# Altium project PWM.PrjPcb
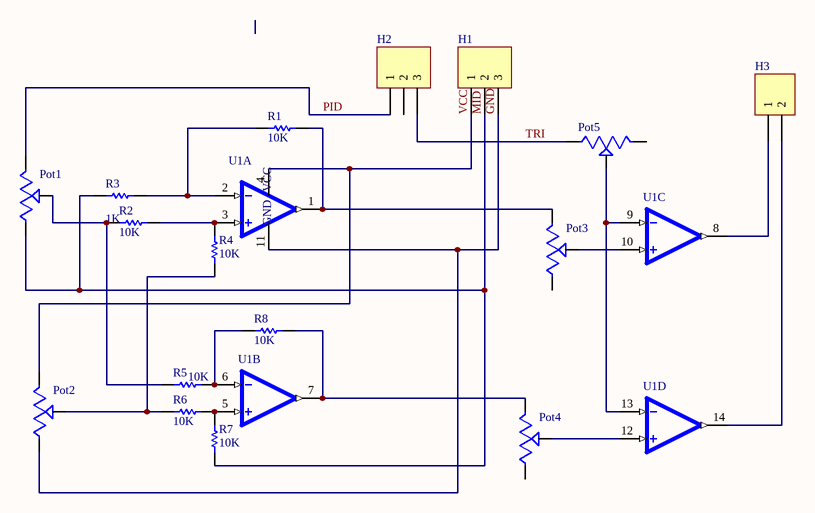
[diagram p0: pwm.SchDoc]
1 sheet, 17 parts. Net scope: global (net labels, ports and power ports of the same name join across sheets).
Board file: PWM.PcbDoc

## Sheet pwm.SchDoc
size A

### Parts
H1  Header 3  [HDR1X3]  (value not drawn)
H2  Header 3  [HDR1X3]  (value not drawn)
H3  Header 2  [HDR1X2]  (value not drawn)
Pot1  3266W-1-103  [TRIM_3266W-1-103]  (value not drawn)
Pot2  3266W-1-103  [TRIM_3266W-1-103]  (value not drawn)
Pot3  3266W-1-103  [TRIM_3266W-1-103]  (value not drawn)
Pot4  3266W-1-103  [TRIM_3266W-1-103]  (value not drawn)
Pot5  3266W-1-103  [TRIM_3266W-1-103]  (value not drawn)
R1  10K  [AXIAL-0.3]
R2  10K  [AXIAL-0.3]
R3  value 1K  [AXIAL-0.3]  (hidden comment: Res1)
R4  10K  [AXIAL-0.3]
R5  10K  [AXIAL-0.3]
R6  10K  [AXIAL-0.3]
R7  10K  [AXIAL-0.3]
R8  10K  [AXIAL-0.3]
U1  LM324NE3  [DIP794W45P254L1969H508Q14]  (value not drawn)  (parts A,B,C,D of 4)

### Nets
GND: H1.3 Pot2.1(CCW) U1.11(GND)
MID: H1.2 Pot1.1(CCW) R3.1 R7.1
PID: H2.1 Pot1.3(CW)
TRI: H2.3 Pot5.1(CCW)
VCC: H1.1 Pot2.3(CW) U1.4(VCC)
NetH3_1: H3.1 U1.8(3OUT)
NetH3_2: H3.2 U1.14(4OUT)
NetPot1_2: Pot1.2(WIPER) R2.2 R5.2
NetPot2_2: Pot2.2(WIPER) R4.2 R6.2
NetPot3_2: Pot3.2(WIPER) U1.10(3IN+)
NetPot3_3: Pot3.3(CW) R1.2 U1.1(1OUT)
NetPot4_2: Pot4.2(WIPER) U1.12(4IN+)
NetPot4_3: Pot4.3(CW) R8.2 U1.7(2OUT)
NetPot5_2: Pot5.2(WIPER) U1.9(3IN-) U1.13(4IN-)
NetR1_1: R1.1 R3.2 U1.2(1IN-)
NetR2_1: R2.1 R4.1 U1.3(1IN+)
NetR5_1: R5.1 R8.1 U1.6(2IN-)
NetR6_1: R6.1 R7.2 U1.5(2IN+)

Not connected (* = marked no-connect by the designer): H2 2; Pot3 1(CCW); Pot4 1(CCW); Pot5 3(CW)

### Library data of the parts
H1 H2 = Header 3: Header, 3-Pin; LatestRevisionDate: 17-Jul-2002; LatestRevisionNote: Re-released for DXP Platform.; Publisher: Altium Limited
H3 = Header 2: Header, 2-Pin; LatestRevisionDate: 17-Jul-2002; LatestRevisionNote: Re-released for DXP Platform.; Publisher: Altium Limited
Pot1-Pot5 = 3266W-1-103: 10 kOhms 0.25W, 1/4W PC Pins Through Hole Trimmer Potentiometer Cermet 12 Turn Top Adjustment; MF: Bourns; Price: None; SnapEDA_Link: https://www.snapeda.com/parts/3266W-1-103/Bourns/view-part/512920/?ref=snap; MP: 3266W-1-103; Check_prices: https://www.snapeda.com/parts/3266W-1-103/Bourns/view-part/512920/?ref=eda; Availability: Warning; Purchase-URL: https://pricing.snapeda.com/search/part/3266W-1-103/?ref=eda; Value: *; Package: TO-218 Bourns
R1 = Res1: Published: 8-Jun-2000; LatestRevisionDate: 17-Jul-2002; LatestRevisionNote: Re-released for DXP Platform.; PackageReference: AXIAL-0.3; Publisher: Altium Limited; PackageDescription: Axial Device, Thru-Hole; 2 Leads; 0.3 in Pin Spacing
R2-R8 = Res1: Resistor; Published: 8-Jun-2000; LatestRevisionDate: 17-Jul-2002; LatestRevisionNote: Re-released for DXP Platform.; PackageReference: AXIAL-0.3; Publisher: Altium Limited; PackageDescription: Axial Device, Thru-Hole; 2 Leads; 0.3 in Pin Spacing
U1 = LM324NE3: Quad, 30-V, 1.2-MHz operational amplifier; MF: Texas Instruments; SnapEDA_Link: https://www.snapeda.com/parts/LM324NE3/Texas+Instruments/view-part/?ref=snap; Package: PDIP-14 Texas Instruments; MP: LM324NE3; Check_prices: https://www.snapeda.com/parts/LM324NE3/Texas+Instruments/view-part/?ref=eda; Purchase-URL: https://pricing.snapeda.com/search/part/LM324NE3/?ref=eda; Price: None; Value: *; Availability: In Stock